# Altium schematic sheet YA-S-Power-Supplies-V1.0.SchDoc: Yet Another IoT BroadRouter
size A4; Revision: 1.0; SheetNumber: 2; SheetTotal: 5
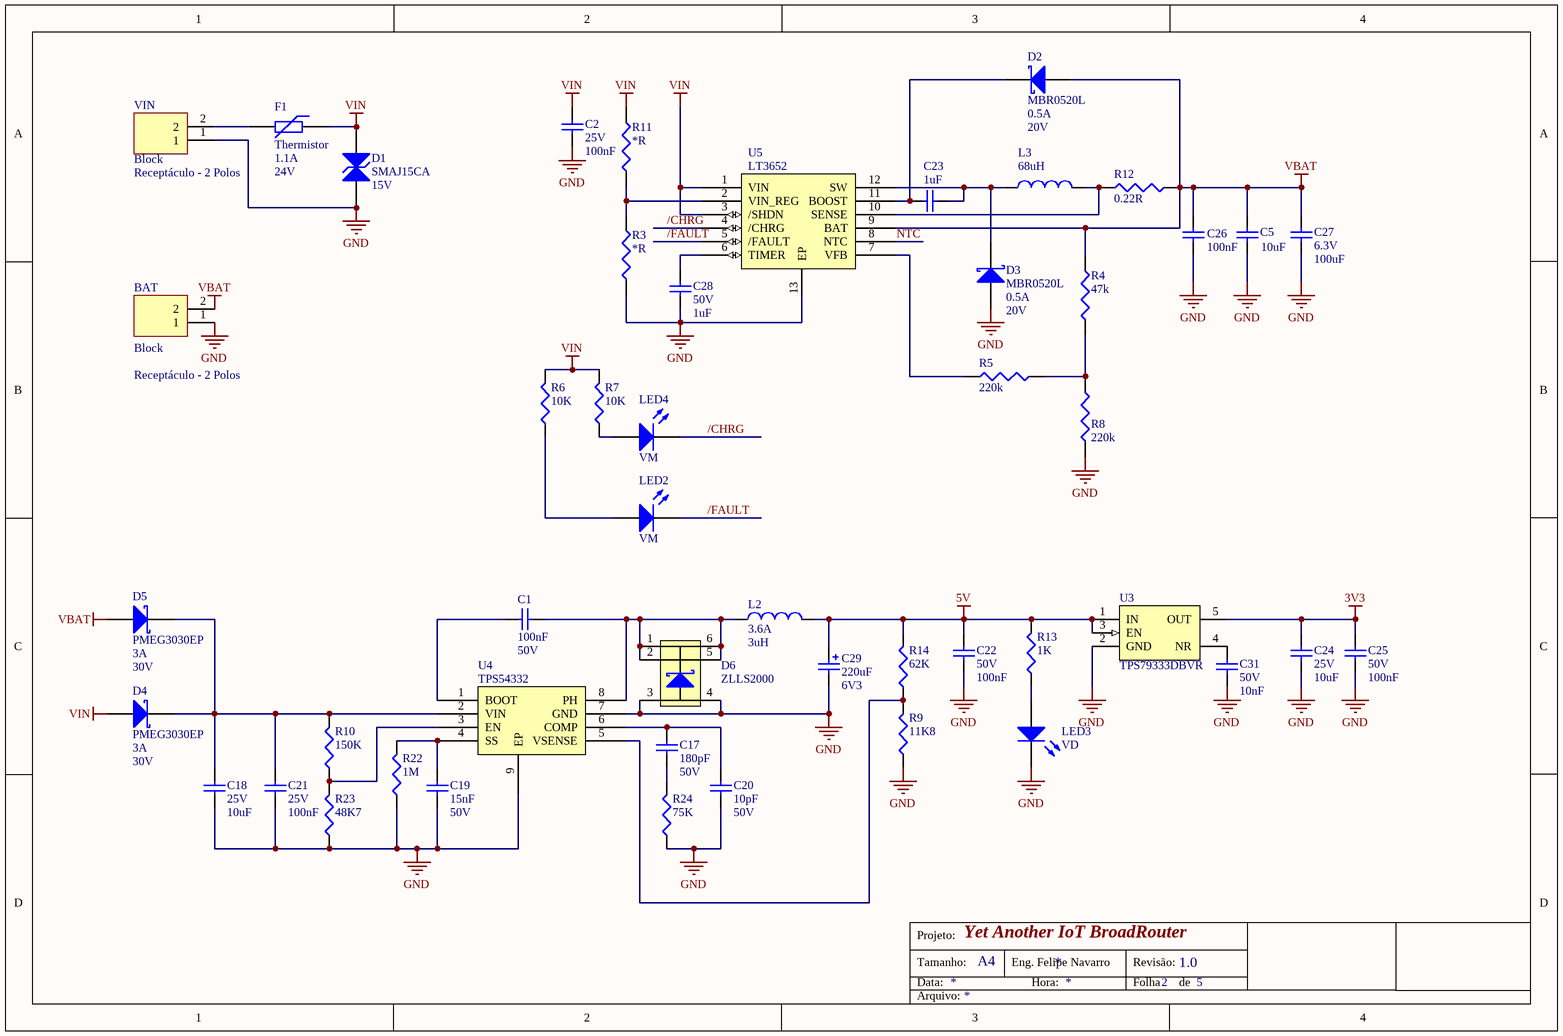
[diagram p0: YA-S-Power-Supplies-V1.0.SchDoc]

## Parts
BAT  Block  value Receptáculo - 2 Polos  [CONN SHRD.BL2 RCPT/ V]
C1  value 100nF  Tensão: 50V  [CC0603]  (hidden comment: Capacitor Cerâmico)
C2  value 100nF  Tensão: 25V  [CC0603]  (hidden comment: Capacitor Cerâmico)
C5  value 10uF  [CC0805]  (hidden comment: Capacitor Cerâmico)
C17  value 180pF  Tensão: 50V  [CC0603]  (hidden comment: Capacitor Cerâmico)
C18  value 10uF  Tensão: 25V  [CC0805]  (hidden comment: Capacitor Cerâmico)
C19  value 15nF  Tensão: 50V  [CC0603]  (hidden comment: Capacitor Cerâmico)
C20  value 10pF  Tensão: 50V  [CC0603]  (hidden comment: Capacitor Cerâmico)
C21  value 100nF  Tensão: 25V  [CC0603]  (hidden comment: Capacitor Cerâmico)
C22  value 100nF  Tensão: 50V  [CC0603]  (hidden comment: Capacitor Cerâmico)
C23  value 1uF  [CC0603]  (hidden comment: Capacitor Cerâmico)
C24  value 10uF  Tensão: 25V  [CC0805]  (hidden comment: Capacitor Cerâmico)
C25  value 100nF  Tensão: 50V  [CC0603]  (hidden comment: Capacitor Cerâmico)
C26  value 100nF  [CC0603]  (hidden comment: Capacitor Cerâmico)
C27  value 100uF  Tensão: 6.3V  [CC1206]  (hidden comment: Capacitor Cerâmico)
C28  value 1uF  Tensão: 50V  [CC0603]  (hidden comment: Capacitor Cerâmico)
C29  value 220uF  Tensão: 6V3  [CPOL2917]  (hidden comment: Capacitor Tântalo)
C31  value 10nF  Tensão: 50V  [CC0603]  (hidden comment: Capacitor Cerâmico)
D1  SMAJ15CA  Tensão: 15V  [SMA BIDIR]
D2  MBR0520L  Corrente: 0.5A  Tensão: 20V  [SOD-123F]
D3  MBR0520L  Corrente: 0.5A  Tensão: 20V  [SOD-123F]
D4  PMEG3030EP  Corrente: 3A  Tensão: 30V  [SOD-128]
D5  PMEG3030EP  Corrente: 3A  Tensão: 30V  [SOD-128]
D6  ZLLS2000  [SOT-23-6N]
F1  Thermistor  Corrente: 1.1A  Tensão: 24V  [CC1812]
L2  value 3uH  Corrente: 3.6A  [NR2424]  (hidden comment: Indutor)
L3  value 68uH  [MURATA 4600]  (hidden comment: Indutor)
LED2  value VM  [LED 0603]  (hidden comment: LED)
LED3  value VD  [LED 0603]  (hidden comment: LED)
LED4  value VM  [LED 0603]  (hidden comment: LED)
R3  value *R  [CC0603]  (hidden comment: Resistor)
R4  value 47k  [CC0603]  (hidden comment: Resistor)
R5  value 220k  [CC0603]  (hidden comment: Resistor)
R6  value 10K  [CC0603]  (hidden comment: Resistor)
R7  value 10K  [CC0603]  (hidden comment: Resistor)
R8  value 220k  [CC0603]  (hidden comment: Resistor)
R9  value 11K8  [CC0603]  (hidden comment: Resistor)
R10  value 150K  [CC0603]  (hidden comment: Resistor)
R11  value *R  [CC0603]  (hidden comment: Resistor)
R12  value 0.22R  [CC1206]  (hidden comment: Resistor)
R13  value 1K  [CC0603]  (hidden comment: Resistor)
R14  value 62K  [CC0603]  (hidden comment: Resistor)
R22  value 1M  [CC0603]  (hidden comment: Resistor)
R23  value 48K7  [CC0603]  (hidden comment: Resistor)
R24  value 75K  [CC0603]  (hidden comment: Resistor)
U3  TPS79333DBVR  [SOT-23-5N]
U4  TPS54332  [SOIC-8N-EP]
U5  LT3652  [MSOP-12N_EP]
VIN  Block  value Receptáculo - 2 Polos  [CONN SHRD.BL2 RCPT/ V]

## Nets
3V3: C24.2 C25.2 U3.5(OUT)
5V: C22.2 C29.1 L2.2 R13.2 R14.2 U3.1(IN) U3.3(EN)
GND: BAT.1 C2.1 C5.1 C18.1 C19.1 C20.1 C21.1 C22.1 C24.1 C25.1 C26.1 C27.1 C28.1 C29.2 C31.1 D1.1(A) D3.1(A) D6.3(A) D6.4(A) LED3.2(K) R3.1 R8.1 R9.1 R22.1 R23.1 R24.1 U3.2(GND) U4.7(GND) U4.9(EP) U5.13(EP) VIN.1
VBAT: BAT.2 C5.2 C26.2 C27.2 D2.1(A) D5.1(A) R4.2 R12.2 U5.9(BAT)
VIN: C2.2 D1.2(K) D4.1(A) F1.1 R6.2 R7.2 R11.2 U5.1(VIN) U5.3(/SHDN)
/CHRG: LED4.2(K) U5.4(/CHRG)
/FAULT: LED2.2(K) U5.5(/FAULT)
NTC: U5.8(NTC)
NetC1_1: C1.1 D6.1(C) D6.2(C) D6.5(C) D6.6(C) L2.1 U4.8(PH)
NetC1_2: C1.2 U4.1(BOOT)
NetC17_1: C17.1 R24.2
NetC17_2: C17.2 C20.2 U4.6(COMP)
NetC18_2: C18.2 C21.2 D4.2(K) D5.2(K) R10.2 U4.2(VIN)
NetC19_2: C19.2 R22.2 U4.4(SS)
NetC23_1: C23.1 D2.2(K) U5.11(BOOST)
NetC23_2: C23.2 D3.2(K) L3.1 U5.12(SW)
NetC28_2: C28.2 U5.6(TIMER)
NetC31_2: C31.2 U3.4(NR)
NetF1_2: F1.2 VIN.2
NetL3_2: L3.2 R12.1 U5.10(SENSE)
NetLED2_1: LED2.1(A) R6.1
NetLED3_1: LED3.1(A) R13.1
NetLED4_1: LED4.1(A) R7.1
NetR3_2: R3.2 R11.1 U5.2(VIN_REG)
NetR4_1: R4.1 R5.1 R8.2
NetR5_2: R5.2 U5.7(VFB)
NetR9_2: R9.2 R14.1 U4.5(VSENSE)
NetR10_1: R10.1 R23.2 U4.3(EN)

## Notes on the sheet
- Projeto:
- Tamanho:
- Data:
- A4
- Eng. Felipe Navarro
- Hora:
- Revisão:
- Folha
- de
- Arquivo:

## Library data of the parts
BAT VIN = SHRD Block 2P RCPT-V P5.08mm: Conector Shrouded Block; ChinesePrice: 0,03930; Chinês: Local; Corrente: 15A; Tensão: 300V; Potência: *; Supplier 1: Digi-Key; Supplier Part Number 1: A98321-ND; Obs:: *; Tolerância: *; ComponentLink1Description: Datasheet; ComponentLink1URL: D:\Tecnoclade\Datasheet\!DataMissing.pdf
C1 = Cap 100nF 50V 0603 X7R: Capacitor (Semiconductor SIM Model); ChinesePrice: 0,00250; Chinês: Local; Corrente: *A; Potência: *W; Tolerância: ±10%; Obs:: X7R; Supplier 1: Digi-Key; Supplier Part Number 1: 1276-1000-1-ND; ComponentLink1Description: Datasheet; ComponentLink1URL: D:\Tecnoclade\Datasheet\!DataMissing.pdf
C2 C21 C26 = Cap 100nF 25V 0603 X7R: Capacitor (Semiconductor SIM Model); Chinês: Local; ChinesePrice: 0,00246; Corrente: *A; Potência: *W; Obs:: X7R; Tolerância: ±10%; Supplier 1: Digi-Key; Supplier Part Number 1: 490-1524-1-ND; ComponentLink1Description: Datasheet; ComponentLink1URL: D:\Tecnoclade\Datasheet\!DataMissing.pdf
C5 = Cap 10uF 50V 1206 X5R: Capacitor (Semiconductor SIM Model); Chinês: -----; ChinesePrice: 0,00000; Corrente: *A; Potência: *W; Obs:: X5R, CL31A106KBHNNNE; Tolerância: ±10%; Supplier 1: Digi-Key; Supplier Part Number 1: 1276-2876-1-ND; ComponentLink1Description: Datasheet; ComponentLink1URL: D:\Tecnoclade\Datasheet\!DataMissing.pdf
C17 = Cap 180pF 50V 0603 NP0: Capacitor (Semiconductor SIM Model); ChinesePrice: 0,00360; Chinês: Local; Corrente: *A; Potência: *W; Tolerância: ±5%; Obs:: NP0; Supplier 1: Digi-Key; Supplier Part Number 1: 1276-1255-1-ND; ComponentLink1Description: Datasheet; ComponentLink1URL: D:\Tecnoclade\Datasheet\!DataMissing.pdf
C18 C24 = Cap 10uF 25V 0805 X5R: Capacitor (Semiconductor SIM Model); Chinês: Local; ChinesePrice: 0,02620; Corrente: *A; Potência: *W; Obs:: X5R; Tolerância: ±10%; Supplier 1: Digi-Key; Supplier Part Number 1: 587-2985-1-ND; ComponentLink1Description: Datasheet; ComponentLink1URL: D:\Tecnoclade\Datasheet\!DataMissing.pdf
C19 = Cap 15nF 50V 0603 X7R: Capacitor (Semiconductor SIM Model); ChinesePrice: 0,00500; Chinês: Local; Corrente: *A; Potência: *W; Tolerância: ±10%; Obs:: X7R; Supplier 1: Digi-Key; Supplier Part Number 1: 445-5189-1-ND; ComponentLink1Description: Datasheet; ComponentLink1URL: D:\Tecnoclade\Datasheet\!DataMissing.pdf
C20 = Cap 10pF 50V 0603 NP0 5%: Capacitor (Semiconductor SIM Model); ChinesePrice: 0,00180; Chinês: Local; Corrente: *A; Potência: *W; Tolerância: ±5%; Obs:: NP0; Supplier 1: Digi-Key; Supplier Part Number 1: 445-1269-1-ND; ComponentLink1Description: Datasheet; ComponentLink1URL: D:\Tecnoclade\Datasheet\!DataMissing.pdf
C22 C25 = Cap 100nF 50V 0603 X7R: Capacitor (Semiconductor SIM Model); Chinês: Local; ChinesePrice: 0,00250; Corrente: *A; Potência: *W; Obs:: X7R; Tolerância: ±10%; Supplier 1: Digi-Key; Supplier Part Number 1: 1276-1000-1-ND; ComponentLink1Description: Datasheet; ComponentLink1URL: D:\Tecnoclade\Datasheet\!DataMissing.pdf
C23 C28 = Cap 1uF 50V 0603 X5R: Capacitor (Semiconductor SIM Model); Chinês: Local; ChinesePrice: 0,01100; Corrente: *A; Potência: *W; Obs:: X5R; Tolerância: ±10%; Supplier 1: Digi-Key; Supplier Part Number 1: 587-2400-1-ND; ComponentLink1Description: Datasheet; ComponentLink1URL: D:\Tecnoclade\Datasheet\!DataMissing.pdf
C27 = Cap 100uF 6.3V 1206 X5R: Capacitor (Semiconductor SIM Model); Chinês: -----; ChinesePrice: 0,00000; Corrente: *A; Potência: *W; Obs:: X5R; Tolerância: ±20%; Supplier 1: Digi-Key; Supplier Part Number 1: 490-7217-1-ND; ComponentLink1Description: Datasheet; ComponentLink1URL: D:\Tecnoclade\Datasheet\!DataMissing.pdf
C29 = PCap 220uF 6V3 2917 LOESR: Polarized Capacitor; ChinesePrice: 0,28500; Chinês: Local; Corrente: 3.5A (Ripple); Potência: *W; Obs: LOESR (0R009); Tolerância: ±20%; Supplier 1: Digi-Key; Supplier Part Number 1: 1189-1687-1-ND; ComponentLink1Description: Datasheet; ComponentLink1URL: D:\Tecnoclade\Datasheet\!DataMissing.pdf
C31 = Cap 10nF 50V 0603 X7R 5%: Capacitor (Semiconductor SIM Model); Chinês: Local; ChinesePrice: 0,00320; Corrente: *A; Potência: *W; Obs:: X7R; Tolerância: ±5%; Supplier 1: Digi-Key; Supplier Part Number 1: 399-1092-1-ND; ComponentLink1Description: Datasheet; ComponentLink1URL: D:\Tecnoclade\Datasheet\!DataMissing.pdf
D1 = TVS 15V 5% SMA BI 400W: Transient Voltage Supressor diode; ChinesePrice: 0,05900; Chinês: Local; Potência: 400W; Value: TVS; Obs:: Bidirecional; Tolerância: ±5%; Corrente: *; Supplier 1: Digi-Key; Supplier Part Number 1: SMAJ15CABCT-ND; ComponentLink1Description: Datasheet; ComponentLink1URL: D:\Tecnoclade\Datasheet\!DataMissing.pdf
D2 D3 = DS 20V 0.5A 385mV SOD-123: Schottky Diode; ChinesePrice: 0,00000; Chinês: ----; Value: Vf=385mV@500mA; Obs:: Fast Recovery =< 500ns, > 200mA (Io); Potência: *; Supplier 1: Digi-Key; Supplier Part Number 1: MBR0520L-TPMSCT-ND; Tolerância: *; ComponentLink1Description: Datasheet; ComponentLink1URL: D:\Tecnoclade\Datasheet\!DataMissing.pdf
D4 D5 = DS 30V 3A SOD-128: Schottky Diode; ChinesePrice: 0,16100; Chinês: Local; Value: Vf=360mV @ 3A; Obs: Fast Recovery =< 500ns, > 200mA (Io); Supplier 1: Digi-Key; Supplier Part Number 1: 1727-5324-1-ND; ComponentLink1Description: Datasheet; ComponentLink1URL: D:\Tecnoclade\Datasheet\!DataMissing.pdf
D6 = ZLLS2000: Power Shottky; Tensão: 40V; Corrente: 2.2A; ChinesePrice: 0,33990; Chinês: Local; Supplier 1: Digi-Key; Supplier Part Number 1: ZLLS2000CT-ND; Potência: *; Value: *; ComponentLink1Description: Datasheet; ComponentLink1URL: D:\Tecnoclade\Datasheet\!DataMissing.pdf; Tolerância: *; Obs:: *
F1 = Res Varistor: Varistor (Voltage-Sensitive Resistor); ChinesePrice: 0,09500; Chinês: Local; Supplier 1: Digi-Key; Supplier Part Number 1: 507-1501-1-ND; ComponentLink1Description: Datasheet; ComponentLink1URL: D:\Tecnoclade\Datasheet\!DataMissing.pdf
L2 = Ind 3uH 2424 3.6A: Inductor; ChinesePrice: 0,00000; Chinês: ----; Obs:: (0R023)@100MHz; Tolerância: ±30%; Potência: *; Supplier 1: Digi-Key; Supplier Part Number 1: 587-2099-1-ND; Tensão: *; ComponentLink1Description: Datasheet; ComponentLink1URL: D:\Tecnoclade\Datasheet\!DataMissing.pdf
L3 = Ind 68uH 1.05A: Inductor; ChinesePrice: 0,00000; Chinês: -----; Obs:: Z=0R0251; Supplier 1: Digi-Key; Supplier Part Number 1: 811-1181-1-ND; Tensão: *; ComponentLink1Description: Datasheet; ComponentLink1URL: http://www.murata-ps.com/data/magnetics/kmp_4600.pdf
LED2 LED4 = LED: ChinesePrice: 0,00000; Chinês: ----; Corrente: *; Potência: *; Supplier 1: Digi-Key; Supplier Part Number 1: 160-1479-1-ND; Tensão: *; Obs:: *; Tolerância: *; ComponentLink1Description: Datasheet; ComponentLink1URL: D:\Tecnoclade\Datasheet\!DataMissing.pdf
LED3 = LED 0603 VD 2V 75mW: ChinesePrice: 0,02810; Chinês: Local; Corrente: 20mA; Potência: 75mW; Tensão: 2V; Obs:: 35mcd@130º; Supplier 1: Digi-Key; Supplier Part Number 1: 160-1478-1-ND; Tolerância: *; ComponentLink1Description: Datasheet; ComponentLink1URL: D:\Tecnoclade\Datasheet\!DataMissing.pdf
R3-R5 R8 R11 = Res - $Val $% $Footprint $Pot: ChinesePrice: 0,00000; Chinês: ----; Corrente: *A; Potência: 1/10W; Tensão: *V; Tolerância: ±*%; Supplier 1: Digi-Key; Supplier Part Number 1: --Del; Obs:: *; ComponentLink1Description: Datasheet; ComponentLink1URL: D:\Tecnoclade\Datasheet\!DataMissing.pdf
R6 R7 = Res 10K 1% 0603 1/10W: ChinesePrice: 0,00089; Chinês: Local; Corrente: *A; Potência: 1/10W; Tensão: *V; Tolerância: ±1%; Supplier 1: Digi-Key; Supplier Part Number 1: P10.0KHCT-ND; Obs: *; ComponentLink1Description: Datasheet; ComponentLink1URL: D:\Tecnoclade\Datasheet\!DataMissing.pdf
R9 = Res 11K8 1% 0603 1/10W: Potência: 1/10W; ChinesePrice: 0,00089; Chinês: Local; Corrente: *A; Tensão: *V; Tolerância: ±1%; Supplier 1: Digi-Key; Supplier Part Number 1: 311-11.8KHRCT-ND; ComponentLink1Description: Datasheet; ComponentLink1URL: D:\Tecnoclade\Datasheet\!DataMissing.pdf; Obs: *
R10 = Res 150K 1% 0603 1/10W: Potência: 1/10W; ChinesePrice: 0,00089; Chinês: Local; Corrente: *A; Tensão: *V; Tolerância: ±1%; Supplier 1: Digi-Key; Supplier Part Number 1: P150KHCT-ND; ComponentLink1Description: Datasheet; ComponentLink1URL: D:\Tecnoclade\Datasheet\!DataMissing.pdf; Obs: *
R12 = Res 0.22R 1% 1206 1/4W: ChinesePrice: 0,00000; Chinês: ----; Corrente: *A; Potência: 1/4W; Tensão: *V; Tolerância: 1%; Supplier 1: Digi-Key; Supplier Part Number 1: P.22RCT-ND; Obs:: *; ComponentLink1Description: Datasheet; ComponentLink1URL: http://industrial.panasonic.com/lecs/www-data/pdf/AOA0000/AOA0000CE3.pdf
R13 = Res 1K 1% 0603 1/10W: ChinesePrice: 0,00089; Chinês: Local; Corrente: *A; Potência: 1/10W; Tensão: *V; Tolerância: ±1%; Supplier 1: Digi-Key; Supplier Part Number 1: RMCF0603FT1K00CT-ND; Obs: *; ComponentLink1Description: Datasheet; ComponentLink1URL: D:\Tecnoclade\Datasheet\!DataMissing.pdf
R14 = Res 62K 1% 0603 1/10W: Potência: 1/10W; ChinesePrice: 0,00089; Chinês: Local; Corrente: *A; Tensão: *V; Tolerância: ±1%; Supplier 1: Digi-Key; Supplier Part Number 1: 311-62.0KHRCT-ND; ComponentLink1Description: Datasheet; ComponentLink1URL: D:\Tecnoclade\Datasheet\!DataMissing.pdf; Obs: *
R22 = Res 1M 1% 0603 1/10W: Potência: 1/10W; ChinesePrice: 0,00089; Chinês: Local; Corrente: *A; Tensão: *V; Obs: ±100ppm/ºC; Tolerância: ±1%; Supplier 1: Digi-Key; Supplier Part Number 1: RMCF0603FT1M00CT-ND; ComponentLink1Description: Datasheet; ComponentLink1URL: D:\Tecnoclade\Datasheet\!DataMissing.pdf
R23 = Res 48K7 1% 0603 1/10W: Potência: 1/10W; ChinesePrice: 0,00089; Chinês: Local; Corrente: *A; Tensão: *V; Tolerância: ±1%; Supplier 1: Digi-Key; Supplier Part Number 1: P48.7KHCT-ND; ComponentLink1Description: Datasheet; ComponentLink1URL: D:\Tecnoclade\Datasheet\!DataMissing.pdf; Obs: *
R24 = Res 75K 1% 0603 1/10W: Potência: 1/10W; ChinesePrice: 0,00100; Chinês: Local; Corrente: *A; Tensão: *V; Obs: ±100ppm/ºC; Tolerância: ±1%; Supplier 1: Digi-Key; Supplier Part Number 1: P75.0KHCT-ND; ComponentLink1Description: Datasheet; ComponentLink1URL: D:\Tecnoclade\Datasheet\!DataMissing.pdf
U3 = TPS79333: ULTRALOW-NOISE, HIGH PSRR, FAST RF 200mA LOW-DROPOUT LINEAR  REGULATORS I; Tensão: 3V3; ChinesePrice: 0,00000; Chinês: ----; Corrente: 200mA; Potência: *; Supplier 1: Digi-Key; Supplier Part Number 1: 296-12961-1-ND; Value: *; Obs:: *; Tolerância: *; ComponentLink1Description: Datasheet; ComponentLink1URL: D:\Tecnoclade\Datasheet\
U4 = TPS54332: DC/DC Converter Step-Down 3.5A 28V; ChinesePrice: 0,87200; Chinês: TI; Corrente: 3.5A; Supplier 1: Digi-Key; Supplier Part Number 1: 296-24141-5-ND; ComponentLink1Description: Datasheet; ComponentLink1URL: D:\Tecnoclade\Datasheet\!DataMissing.pdf
U5 = LT3652: Power Tracking 2A Battery  Charger for Solar Power; ChinesePrice: 0,00000; Chinês: ----; Corrente: *; Potência: *; Supplier 1: Digi-Key; Supplier Part Number 1: LT3652EMSE#PBF-ND; Tensão: *; Value: *; Obs:: *; Tolerância: *; ComponentLink1Description: Datasheet; ComponentLink1URL: http://www.linear.com/docs/28522